# EAGLE schematic power_strip_monitor (EAGLE 6.1)
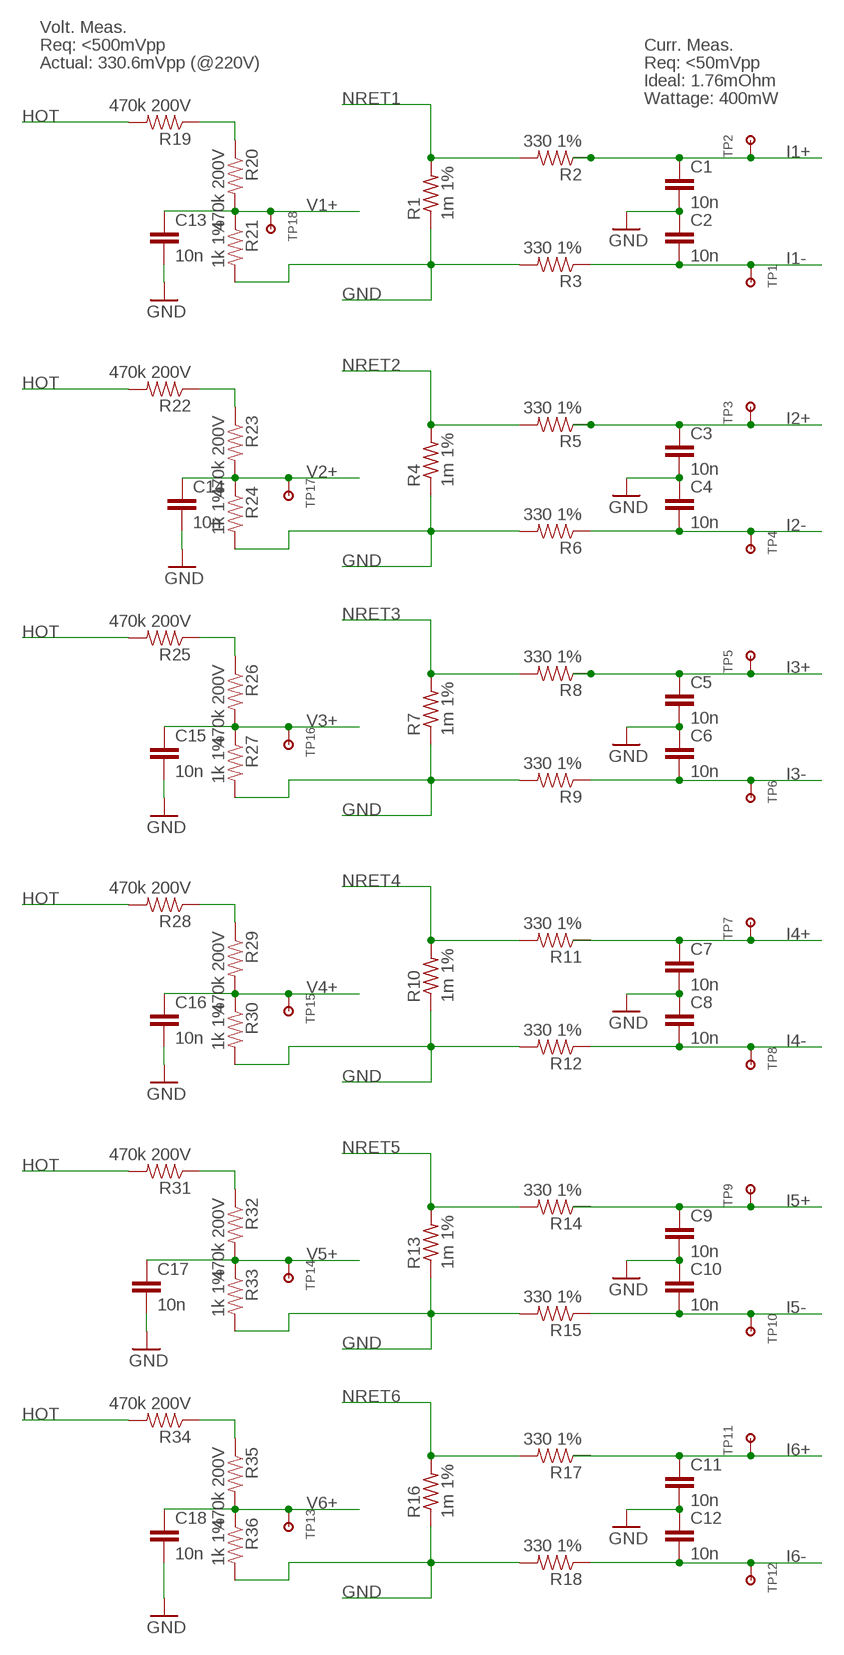
[diagram p0: schematic, sheet 1, part 1 of 2]
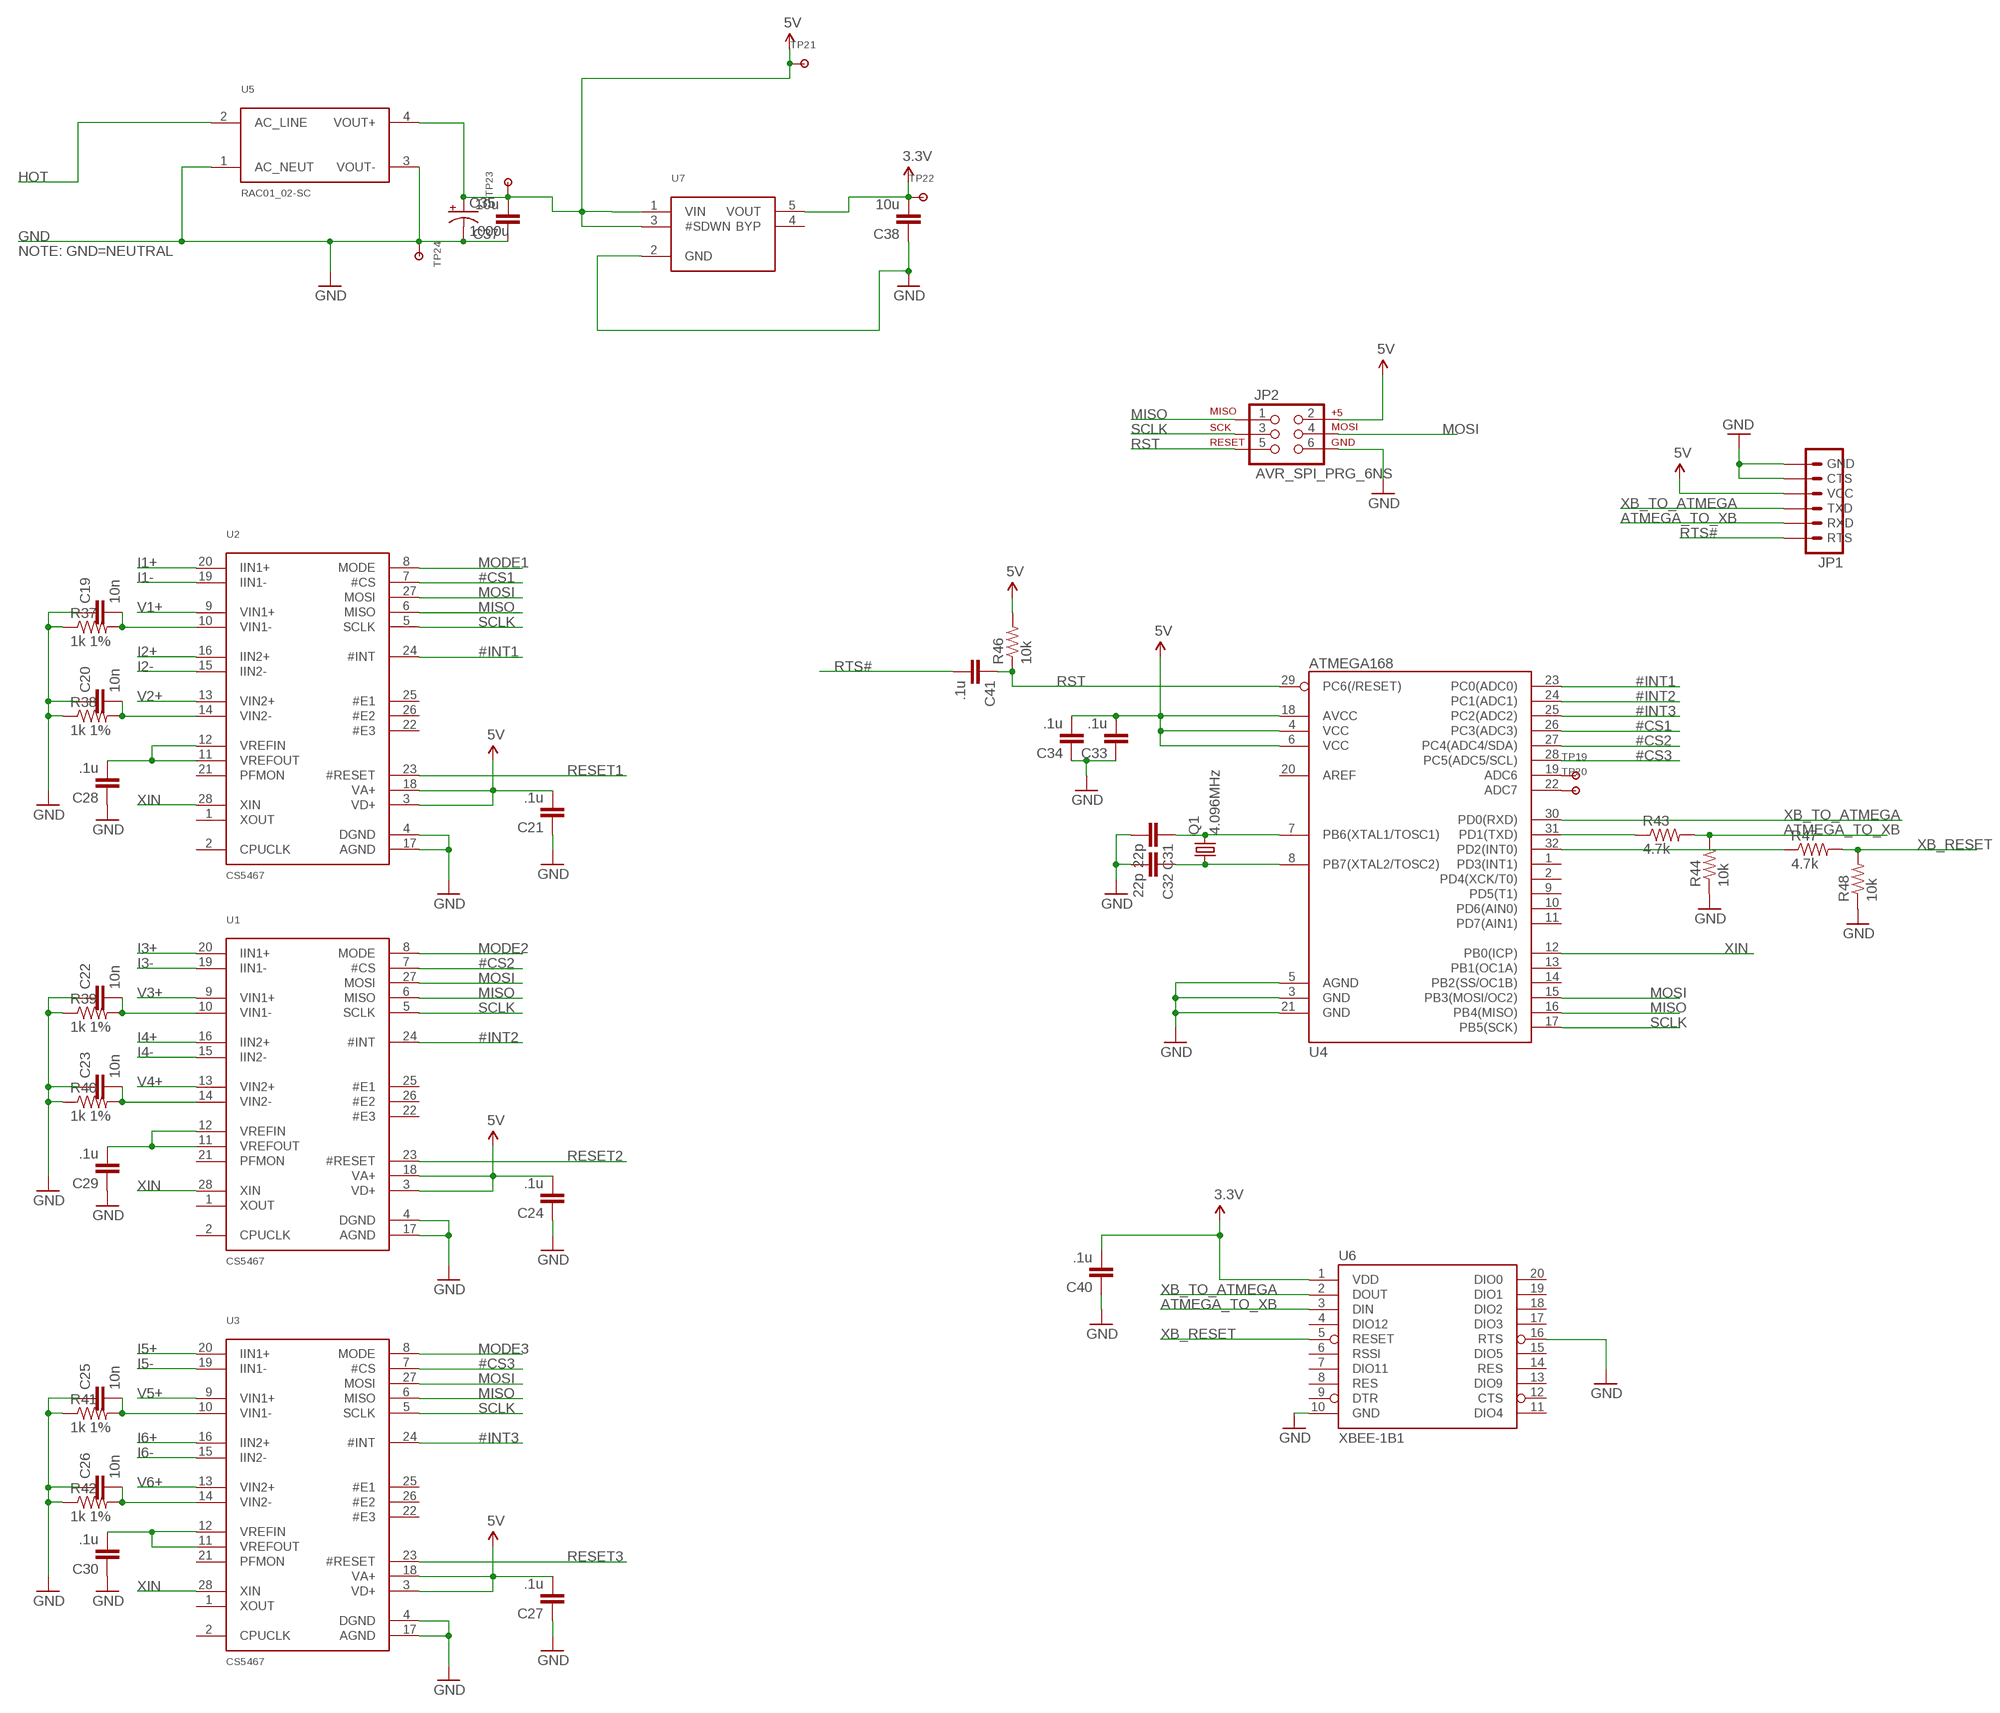
[diagram p1: schematic, sheet 1, part 2 of 2]

## Parts
C1  10n  CAP0603  [0603]
C2  10n  CAP0603  [0603]
C3  10n  CAP0603  [0603]
C4  10n  CAP0603  [0603]
C5  10n  CAP0603  [0603]
C6  10n  CAP0603  [0603]
C7  10n  CAP0603  [0603]
C8  10n  CAP0603  [0603]
C9  10n  CAP0603  [0603]
C10  10n  CAP0603  [0603]
C11  10n  CAP0603  [0603]
C12  10n  CAP0603  [0603]
C13  10n  CAP0603  [0603]
C14  10n  CAP0603  [0603]
C15  10n  CAP0603  [0603]
C16  10n  CAP0603  [0603]
C17  10n  CAP0603  [0603]
C18  10n  CAP0603  [0603]
C19  10n  CAP0603  [0603]
C20  10n  CAP0603  [0603]
C21  .1u  CAP0603  [0603]
C22  10n  CAP0603  [0603]
C23  10n  CAP0603  [0603]
C24  .1u  CAP0603  [0603]
C25  10n  CAP0603  [0603]
C26  10n  CAP0603  [0603]
C27  .1u  CAP0603  [0603]
C28  .1u  CAP0603  [0603]
C29  .1u  CAP0603  [0603]
C30  .1u  CAP0603  [0603]
C31  22p  CAP0603  [0603]
C32  22p  CAP0603  [0603]
C33  .1u  CAP0603  [0603]
C34  .1u  CAP0603  [0603]
C35  1000u  CPOL-USG  [PANASONIC_G]
C37  10u  CAP0603  [0603]
C38  10u  CAP0603  [0603]
C40  .1u  CAP0603  [0603]
C41  .1u  CAP0603  [0603]
JP1  FTDI_CABLESIP  [1X06]
JP2  AVR_SPI_PRG_6NS  [2X3-NS]
Q1  4.096MHz  CRYSTALSMD  [HC49UP]
R1  1m 1%  R-US_R2512  [R2512]
R2  330 1%  RESISTOR0603  [0603]
R3  330 1%  RESISTOR0603  [0603]
R4  1m 1%  R-US_R2512  [R2512]
R5  330 1%  RESISTOR0603  [0603]
R6  330 1%  RESISTOR0603  [0603]
R7  1m 1%  R-US_R2512  [R2512]
R8  330 1%  RESISTOR0603  [0603]
R9  330 1%  RESISTOR0603  [0603]
R10  1m 1%  R-US_R2512  [R2512]
R11  330 1%  RESISTOR0603  [0603]
R12  330 1%  RESISTOR0603  [0603]
R13  1m 1%  R-US_R2512  [R2512]
R14  330 1%  RESISTOR0603  [0603]
R15  330 1%  RESISTOR0603  [0603]
R16  1m 1%  R-US_R2512  [R2512]
R17  330 1%  RESISTOR0603  [0603]
R18  330 1%  RESISTOR0603  [0603]
R19  470k 200V  RESISTOR1206  [1206]
R20  470k 200V  RESISTOR1206  [1206]
R21  1k 1%  RESISTOR0603  [0603]
R22  470k 200V  RESISTOR1206  [1206]
R23  470k 200V  RESISTOR1206  [1206]
R24  1k 1%  RESISTOR0603  [0603]
R25  470k 200V  RESISTOR1206  [1206]
R26  470k 200V  RESISTOR1206  [1206]
R27  1k 1%  RESISTOR0603  [0603]
R28  470k 200V  RESISTOR1206  [1206]
R29  470k 200V  RESISTOR1206  [1206]
R30  1k 1%  RESISTOR0603  [0603]
R31  470k 200V  RESISTOR1206  [1206]
R32  470k 200V  RESISTOR1206  [1206]
R33  1k 1%  RESISTOR0603  [0603]
R34  470k 200V  RESISTOR1206  [1206]
R35  470k 200V  RESISTOR1206  [1206]
R36  1k 1%  RESISTOR0603  [0603]
R37  1k 1%  RESISTOR0603  [0603]
R38  1k 1%  RESISTOR0603  [0603]
R39  1k 1%  RESISTOR0603  [0603]
R40  1k 1%  RESISTOR0603  [0603]
R41  1k 1%  RESISTOR0603  [0603]
R42  1k 1%  RESISTOR0603  [0603]
R43  4.7k  RESISTOR0603  [0603]
R44  10k  RESISTOR0603  [0603]
R46  10k  RESISTOR0603  [0603]
R47  4.7k  RESISTOR0603  [0603]
R48  10k  RESISTOR0603  [0603]
TP1  TESTPOINTSMALLEST  [TESTPOINT]
TP2  TESTPOINTSMALLEST  [TESTPOINT]
TP3  TESTPOINTSMALLEST  [TESTPOINT]
TP4  TESTPOINTSMALLEST  [TESTPOINT]
TP5  TESTPOINTSMALLEST  [TESTPOINT]
TP6  TESTPOINTSMALLEST  [TESTPOINT]
TP7  TESTPOINTSMALLEST  [TESTPOINT]
TP8  TESTPOINTSMALLEST  [TESTPOINT]
TP9  TESTPOINTSMALLEST  [TESTPOINT]
TP10  TESTPOINTSMALLEST  [TESTPOINT]
TP11  TESTPOINTSMALLEST  [TESTPOINT]
TP12  TESTPOINTSMALLEST  [TESTPOINT]
TP13  TESTPOINTSMALLEST  [TESTPOINT]
TP14  TESTPOINTSMALLEST  [TESTPOINT]
TP15  TESTPOINTSMALLEST  [TESTPOINT]
TP16  TESTPOINTSMALLEST  [TESTPOINT]
TP17  TESTPOINTSMALLEST  [TESTPOINT]
TP18  TESTPOINTSMALLEST  [TESTPOINT]
TP19  TESTPOINTSMALLEST  [TESTPOINT]
TP20  TESTPOINTSMALLEST  [TESTPOINT]
TP21  TESTPOINT100MIL  [TESTPOINT-100MIL]
TP22  TESTPOINT100MIL  [TESTPOINT-100MIL]
TP23  TESTPOINT100MIL  [TESTPOINT-100MIL]
TP24  TESTPOINT100MIL  [TESTPOINT-100MIL]
U1  CS5467  [SSOP28L_CIRRUS]
U2  CS5467  [SSOP28L_CIRRUS]
U3  CS5467  [SSOP28L_CIRRUS]
U4  ATMEGA168  [TQFP32-08]
U5  RAC01_02-SC  [RAC01_02-SC]
U6  XBEE-1B1  [XBEE-1]
U7  LT1761-X  [TSOT23-5_LINEAR]

## Nets
3.3V: C38.2 C40.2 TP22.2 U6.1(VDD) U7.5(VOUT)
5V: C21.2 C24.2 C27.2 C33.2 C34.2 C35.+ C37.2 JP1.3(VCC) JP2.2 R46.2 TP21.2 TP23.2 U1.3(VD+) U1.18(VA+) U2.3(VD+) U2.18(VA+) U3.3(VD+) U3.18(VA+) U4.4(VCC) U4.6(VCC) U4.18(AVCC) U5.4(VOUT+) U7.1(VIN) U7.3(#SDWN)
#CS1: U2.7(#CS) U4.26(PC3(ADC3))
#CS2: U1.7(#CS) U4.27(PC4(ADC4/SDA))
#CS3: U3.7(#CS) U4.28(PC5(ADC5/SCL))
#INT1: U2.24(#INT) U4.23(PC0(ADC0))
#INT2: U1.24(#INT) U4.24(PC1(ADC1))
#INT3: U3.24(#INT) U4.25(PC2(ADC2))
ATMEGA_TO_XB: JP1.5(RXD) R43.2 R44.2 U6.3(DIN)
GND: C1.2 C2.1 C3.2 C4.1 C5.2 C6.1 C7.2 C8.1 C9.2 C10.1 C11.2 C12.1 C13.2 C14.2 C15.2 C16.2 C17.2 C18.2 C19.1 C20.1 C21.1 C22.1 C23.1 C24.1 C25.1 C26.1 C27.1 C28.1 C29.1 C30.1 C31.2 C32.2 C33.1 C34.1 C35.- C37.1 C38.1 C40.1 JP1.1(GND) JP1.2(CTS) JP2.6 R1.1 R3.2 R4.1 R6.2 R7.1 R9.2 R10.1 R12.2 R13.1 R15.2 R16.1 R18.2 R21.2 R37.1 R38.1 R39.1 R40.1 R41.1 R42.1 R44.1 R48.1 TP24.2 U1.4(DGND) U1.17(AGND) U2.4(DGND) U2.17(AGND) U3.4(DGND) U3.17(AGND) U4.3(GND) U4.5(AGND) U4.21(GND) U5.1(AC_NEUT) U5.3(VOUT-) U6.10(GND) U6.16(RTS) U7.2(GND)
HOT: R19.2 R22.2 R25.2 R28.2 R31.2 R34.2 U5.2(AC_LINE)
I1+: C1.1 R2.1 TP2.P$1 U2.20(IIN1+)
I1-: C2.2 R3.1 TP1.P$1 U2.19(IIN1-)
I2+: C3.1 R5.1 TP3.P$1 U2.16(IIN2+)
I2-: C4.2 R6.1 TP4.P$1 U2.15(IIN2-)
I3+: C5.1 R8.1 TP5.P$1 U1.20(IIN1+)
I3-: C6.2 R9.1 TP6.P$1 U1.19(IIN1-)
I4+: C7.1 TP7.P$1 U1.16(IIN2+)
I4-: C8.2 R12.1 TP8.P$1 U1.15(IIN2-)
I5+: C9.1 TP9.P$1 U3.20(IIN1+)
I5-: C10.2 R15.1 TP10.P$1 U3.19(IIN1-)
I6+: C11.1 TP11.P$1 U3.16(IIN2+)
I6-: C12.2 R18.1 TP12.P$1 U3.15(IIN2-)
MISO: JP2.1 U1.6(MISO) U2.6(MISO) U3.6(MISO) U4.16(PB4(MISO))
MODE1: U2.8(MODE)
MODE2: U1.8(MODE)
MODE3: U3.8(MODE)
MOSI: JP2.4 U1.27(MOSI) U2.27(MOSI) U3.27(MOSI) U4.15(PB3(MOSI/OC2))
N$1: R22.1 R23.1
N$2: R19.1 R20.1
N$3: R25.1 R26.1
N$4: R28.1 R29.1
N$5: R31.1 R32.1
N$6: R34.1 R35.1
N$7: C20.2 R38.2 U2.14(VIN2-)
N$8: C19.2 R37.2 U2.10(VIN1-)
N$9: C23.2 R40.2 U1.14(VIN2-)
N$10: C22.2 R39.2 U1.10(VIN1-)
N$11: C29.2 U1.11(VREFOUT) U1.12(VREFIN)
N$12: C26.2 R42.2 U3.14(VIN2-)
N$13: C25.2 R41.2 U3.10(VIN1-)
N$14: C30.2 U3.11(VREFOUT) U3.12(VREFIN)
N$15: C28.2 U2.11(VREFOUT) U2.12(VREFIN)
N$16: C31.1 Q1.2 U4.7(PB6(XTAL1/TOSC1))
N$17: C32.1 Q1.1 U4.8(PB7(XTAL2/TOSC2))
N$18: TP19.P$1 U4.19(ADC6)
N$19: TP20.P$1 U4.22(ADC7)
N$20: R43.1 U4.31(PD1(TXD))
N$22: R47.1 U4.32(PD2(INT0))
NEUTRAL1: R24.2
NEUTRAL2: R27.2
NEUTRAL3: R30.2
NEUTRAL4: R33.2
NEUTRAL5: R36.2
NRET1: R1.2 R2.2
NRET2: R4.2 R5.2
NRET3: R7.2 R8.2
NRET4: R10.2 R11.2
NRET5: R13.2 R14.2
NRET6: R16.2 R17.2
RESET1: U2.23(#RESET)
RESET2: U1.23(#RESET)
RESET3: U3.23(#RESET)
RST: C41.1 JP2.5 R46.1 U4.29(PC6(/RESET))
RTS#: C41.2 JP1.6(RTS)
SCLK: JP2.3 U1.5(SCLK) U2.5(SCLK) U3.5(SCLK) U4.17(PB5(SCK))
V1+: C13.1 R20.2 R21.1 TP18.P$1 U2.9(VIN1+)
V2+: C14.1 R23.2 R24.1 TP17.P$1 U2.13(VIN2+)
V3+: C15.1 R26.2 R27.1 TP16.P$1 U1.9(VIN1+)
V4+: C16.1 R29.2 R30.1 TP15.P$1 U1.13(VIN2+)
V5+: C17.1 R32.2 R33.1 TP14.P$1 U3.9(VIN1+)
V6+: C18.1 R35.2 R36.1 TP13.P$1 U3.13(VIN2+)
XB_RESET: R47.2 R48.2 U6.5(RESET)
XB_TO_ATMEGA: JP1.4(TXD) U4.30(PD0(RXD)) U6.2(DOUT)
XIN: U1.28(XIN) U2.28(XIN) U3.28(XIN) U4.12(PB0(ICP))
Unconnected: R11.1 R14.1 R17.1 U1.1(XOUT) U1.2(CPUCLK) U1.21(PFMON) U1.22(#E3) U1.25(#E1) U1.26(#E2) U2.1(XOUT) U2.2(CPUCLK) U2.21(PFMON) U2.22(#E3) U2.25(#E1) U2.26(#E2) U3.1(XOUT) U3.2(CPUCLK) U3.21(PFMON) U3.22(#E3) U3.25(#E1) U3.26(#E2) U4.1(PD3(INT1)) U4.2(PD4(XCK/T0)) U4.9(PD5(T1)) U4.10(PD6(AIN0)) U4.11(PD7(AIN1)) U4.13(PB1(OC1A)) U4.14(PB2(SS/OC1B)) U4.20(AREF) U6.4(DIO12) U6.6(RSSI) U6.7(DIO11) U6.8(RES) U6.9(DTR) U6.11(DIO4) U6.12(CTS) U6.13(DIO9) U6.14(RES) U6.15(DIO5) U6.17(DIO3) U6.18(DIO2) U6.19(DIO1) U6.20(DIO0) U7.4(BYP)

## Notes on the sheet
- NOTE: GND=NEUTRAL
- Volt. Meas.
- Req: <500mVpp | Curr. Meas.
- Actual: 330.6mVpp (@220V) | Req: <50mVpp
- Ideal: 1.76mOhm
- Wattage: 400mW

## Library data of the parts
C1-C34 C37 C38 C40 C41 = SparkFun:CAP: Capacitor Standard 0603 ceramic capacitor, and 0.1" leaded capacitor.
C35 = rcl_new:CPOL-US: POLARIZED CAPACITOR, American symbol
JP1 = custom:FTDI_CABLE: Header 6 Standard 6-pin 0.1" header. Use with straight break away headers (SKU : PRT-00116), right angle break away headers (PRT-00553), swiss pins (PRT-00743), machine pins (PRT-00117), and female headers (PRT-00115). Molex polarized connector foot print use with SKU : PRT-08094 with associated crimp pins and housings. NOTES ON THE VARIANTS LOCK and LOCK_LONGPADS... This footprint was designed to help hold the alignment of a through-hole component (i.e. 6-pin header) while soldering it into place. You may notice that each hole has been shifted either up or down by 0.005 of an inch from it's more standard position (which is a perfectly straight line). This slight alteration caused the pins (the squares in the middle) to touch the edges of the holes. Because they are alternating, it causes a "brace" to hold the component in place. 0.005 has proven to be the perfect amount of "off-center" position when using our standard breakaway headers. Although looks a little odd when you look at the bare footprint, once you have a header in there, the alteration is very hard to notice. Also, if you push a header all the way into place, it is covered up entirely on the bottom side. This idea of altering the position of holes to aid alignment will be further integrated into the Sparkfun Library for other footprints. It can help hold any component with 3 or more connection pins.
JP2 = SparkFun:AVR_SPI_PRG_6: AVR ISP 6 Pin This is the reduced ISP connector for AVR programming. Common on Arduino. This footprint will take up less PCB space and can be used with a 10-pin to 6-pin adapter such as SKU: BOB-08508
Q1 = SparkFun:CRYSTAL: Crystals Various standard crystals. Proven footprints. Spark Fun Electronics SKU : COM-00534
R1 R4 R7 R10 R13 R16 = rcl:R-US_: RESISTOR, American symbol
R2 R3 R5 R6 R8 R9 R11 R12 R14 R15 R17-R44 R46-R48 = SparkFun:RESISTOR: Resistor Basic schematic elements and footprints for 0603, 1206, and PTH 1/10th watt (small) resistors.
TP1-TP24 = WSNlib:TESTPOINT: Generic Testpoint
U1-U3 = Cool_Electricity:CS5467: CS5467 Power monitoring chip
U4 = SparkFun:ATMEGA168
U5 = Cool_Electricity:RAC01_02-SC: RAC_01_02-SC AC/DC converter 1W 5V out
U6 = SparkFun:XBEE-1
U7 = Cool_Electricity:LT1761-X: LT1761-X LDO Voltage Regulator